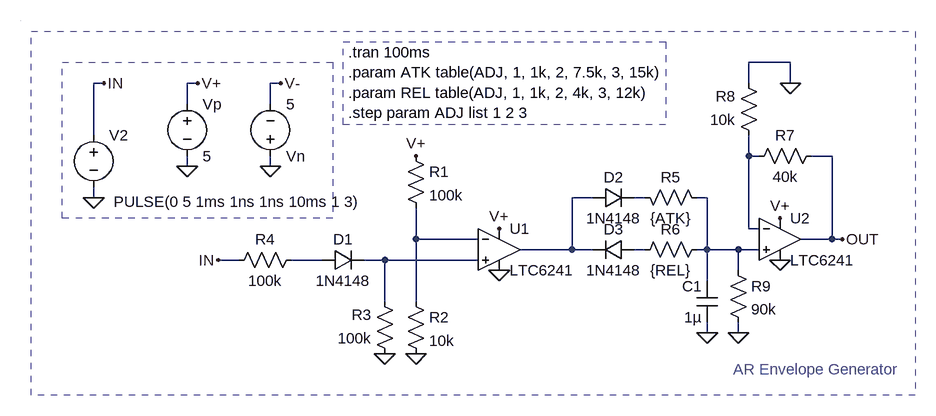
[diagram p0: schematic envelope generator study.asc]
envelope generator study.asc, the LTspice schematic file:
Version 4
SHEET 1 880 680
WIRE 560 -128 496 -128
WIRE -496 -96 -512 -96
WIRE -352 -96 -368 -96
WIRE -224 -96 -240 -96
WIRE 496 -96 496 -128
WIRE 560 -96 560 -128
WIRE -368 -64 -368 -96
WIRE -240 -64 -240 -96
WIRE -512 -16 -512 -96
WIRE 496 16 496 -16
WIRE 512 16 496 16
WIRE 624 16 592 16
WIRE -368 32 -368 16
WIRE -240 32 -240 16
WIRE -512 80 -512 64
WIRE 256 80 224 80
WIRE 336 80 320 80
WIRE 432 80 416 80
WIRE 496 128 496 16
WIRE 512 128 496 128
WIRE -16 144 -16 96
WIRE 80 144 -16 144
WIRE 624 144 624 16
WIRE 624 144 576 144
WIRE 640 144 624 144
WIRE 224 160 224 80
WIRE 224 160 144 160
WIRE 256 160 224 160
WIRE 336 160 320 160
WIRE 432 160 432 80
WIRE 432 160 416 160
WIRE 480 160 432 160
WIRE 512 160 480 160
WIRE -288 176 -320 176
WIRE -160 176 -208 176
WIRE -64 176 -96 176
WIRE 80 176 -64 176
WIRE 480 192 480 160
WIRE 432 208 432 160
WIRE -64 240 -64 176
WIRE -16 240 -16 144
WIRE 432 288 432 272
WIRE 480 288 480 272
FLAG 112 192 0
FLAG -16 320 0
FLAG -352 -96 V+
FLAG -16 16 V+
FLAG 112 128 V+
FLAG -320 176 IN
FLAG -64 320 0
FLAG -512 80 0
FLAG -368 32 0
FLAG 432 288 0
FLAG 544 176 0
FLAG 544 112 V+
FLAG 640 144 OUT
FLAG -224 -96 V-
FLAG 560 -96 0
FLAG -240 32 0
FLAG -496 -96 IN
FLAG 480 288 0
SYMBOL Opamps\\LTC6241 112 160 R0
SYMATTR InstName U1
SYMBOL res -32 0 R0
SYMATTR InstName R1
SYMATTR Value 100k
SYMBOL res -32 224 R0
SYMATTR InstName R2
SYMATTR Value 10k
SYMBOL voltage -368 -80 R0
WINDOW 123 0 0 Left 2
WINDOW 39 0 0 Left 2
SYMATTR InstName Vp
SYMATTR Value 5
SYMBOL diode -160 192 R270
WINDOW 0 32 32 VTop 2
WINDOW 3 0 32 VBottom 2
SYMATTR InstName D1
SYMATTR Value 1N4148
SYMBOL res -48 336 R180
WINDOW 0 36 76 Left 2
WINDOW 3 36 40 Left 2
SYMATTR InstName R3
SYMATTR Value 100k
SYMBOL res -304 192 R270
WINDOW 0 32 56 VTop 2
WINDOW 3 0 56 VBottom 2
SYMATTR InstName R4
SYMATTR Value 100k
SYMBOL voltage -512 -32 R0
WINDOW 123 0 0 Left 2
WINDOW 39 0 0 Left 2
WINDOW 3 31 118 Left 2
SYMATTR Value PULSE(0 5 1ms 1ns 1ns 10ms 1 3)
SYMATTR InstName V2
SYMBOL Opamps\\LTC6241 544 144 R0
SYMATTR InstName U2
SYMBOL diode 320 144 R90
WINDOW 0 0 32 VBottom 2
WINDOW 3 32 32 VTop 2
SYMATTR InstName D3
SYMATTR Value 1N4148
SYMBOL res 320 64 M90
WINDOW 0 0 56 VBottom 2
WINDOW 3 32 56 VTop 2
SYMATTR InstName R5
SYMATTR Value {ATK}
SYMBOL res 320 176 R270
WINDOW 0 32 56 VTop 2
WINDOW 3 0 56 VBottom 2
SYMATTR InstName R6
SYMATTR Value {REL}
SYMBOL cap 448 272 R180
WINDOW 0 24 56 Left 2
WINDOW 3 24 8 Left 2
SYMATTR InstName C1
SYMATTR Value 1µ
SYMBOL voltage -240 32 M180
WINDOW 123 0 0 Left 2
WINDOW 39 0 0 Left 2
SYMATTR InstName Vn
SYMATTR Value 5
SYMBOL res 608 0 R90
WINDOW 0 0 56 VBottom 2
WINDOW 3 32 56 VTop 2
SYMATTR InstName R7
SYMATTR Value 40k
SYMBOL res 512 0 R180
WINDOW 0 36 76 Left 2
WINDOW 3 36 40 Left 2
SYMATTR InstName R8
SYMATTR Value 10k
SYMBOL diode 256 96 R270
WINDOW 0 32 32 VTop 2
WINDOW 3 0 32 VBottom 2
SYMATTR InstName D2
SYMATTR Value 1N4148
SYMBOL res 464 176 R0
SYMATTR InstName R9
SYMATTR Value 90k
TEXT -120 -144 Left 2 !.tran 100ms\n.param ATK table(ADJ, 1, 1k, 2, 7.5k, 3, 15k)\n.param REL table(ADJ, 1, 1k, 2, 4k, 3, 12k)\n.step param ADJ list 1 2 3
TEXT 472 344 Left 2 ;AR Envelope Generator
RECTANGLE Normal -144 112 -560 -128 2
RECTANGLE Normal -624 -192 -624 -192 2
RECTANGLE Normal 752 384 -608 -176 2
RECTANGLE Normal 368 -32 -128 -160 2

The netlist it stands for:
* envelope generator study.asc
XU1 N008 N005 V+ 0 N002 LTC6241  ; pins In+ In- V+ V- OUT
R1 V+ N005 100k
R2 N005 0 10k
Vp V+ 0 5
D1 N007 N008 1N4148
R3 0 N008 100k
R4 IN N007 100k
V2 IN 0 PULSE(0 5 1ms 1ns 1ns 10ms 1 3)
XU2 N004 N001 V+ 0 OUT LTC6241  ; pins In+ In- V+ V- OUT
D3 N006 N002 1N4148
R5 N003 N004 {ATK}
R6 N006 N004 {REL}
C1 0 N004 1µ
Vn 0 V- 5
R7 OUT N001 40k
R8 N001 0 10k
D2 N002 N003 1N4148
R9 N004 0 90k
.model D D
.lib standard.dio
.tran 100ms
.param ATK table(ADJ, 1, 1k, 2, 7.5k, 3, 15k)
.param REL table(ADJ, 1, 1k, 2, 4k, 3, 12k)
.step param ADJ list 1 2 3
* AR Envelope Generator
.lib LTC4.lib
.backanno
.end